# Altium schematic sheet SS56.schdoc
size 49 x 29 mm
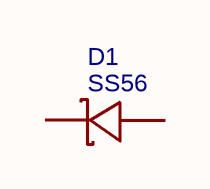
[diagram p0: SS56.schdoc]

## Parts
D1  SS56  [SMA_L4.3-W2.6-LS5.2-RD]

## Nets

Not connected (* = marked no-connect by the designer): D1 1(K) 2(A)

## Library data of the parts
D1 = SS56: BOM_Manufacturer: MDD; BOM_Supplier: LCSC; BOM_Manufacturer Part: SS56; BOM_Supplier Part: C65009; BOM_JLCPCB Part Class: Extended Part; spicePre: D; spiceSymbolName: SS56